# Altium schematic sheet led-schdoc.schdoc
size A; SheetNumber: 1; SheetTotal: 1
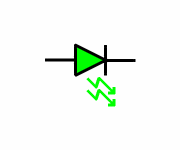
[diagram p0: led-schdoc.schdoc]

## Parts
D?  (no value)

## Nets
NetD?_1: D?.1(A) D?.2(A)

Not connected (* = marked no-connect by the designer): D? 3(K)

## Library data of the parts
D? = LED